# Altium schematic sheet HBridge_Design_1.SchDoc
size B; SheetNumber: 7; SheetTotal: 8
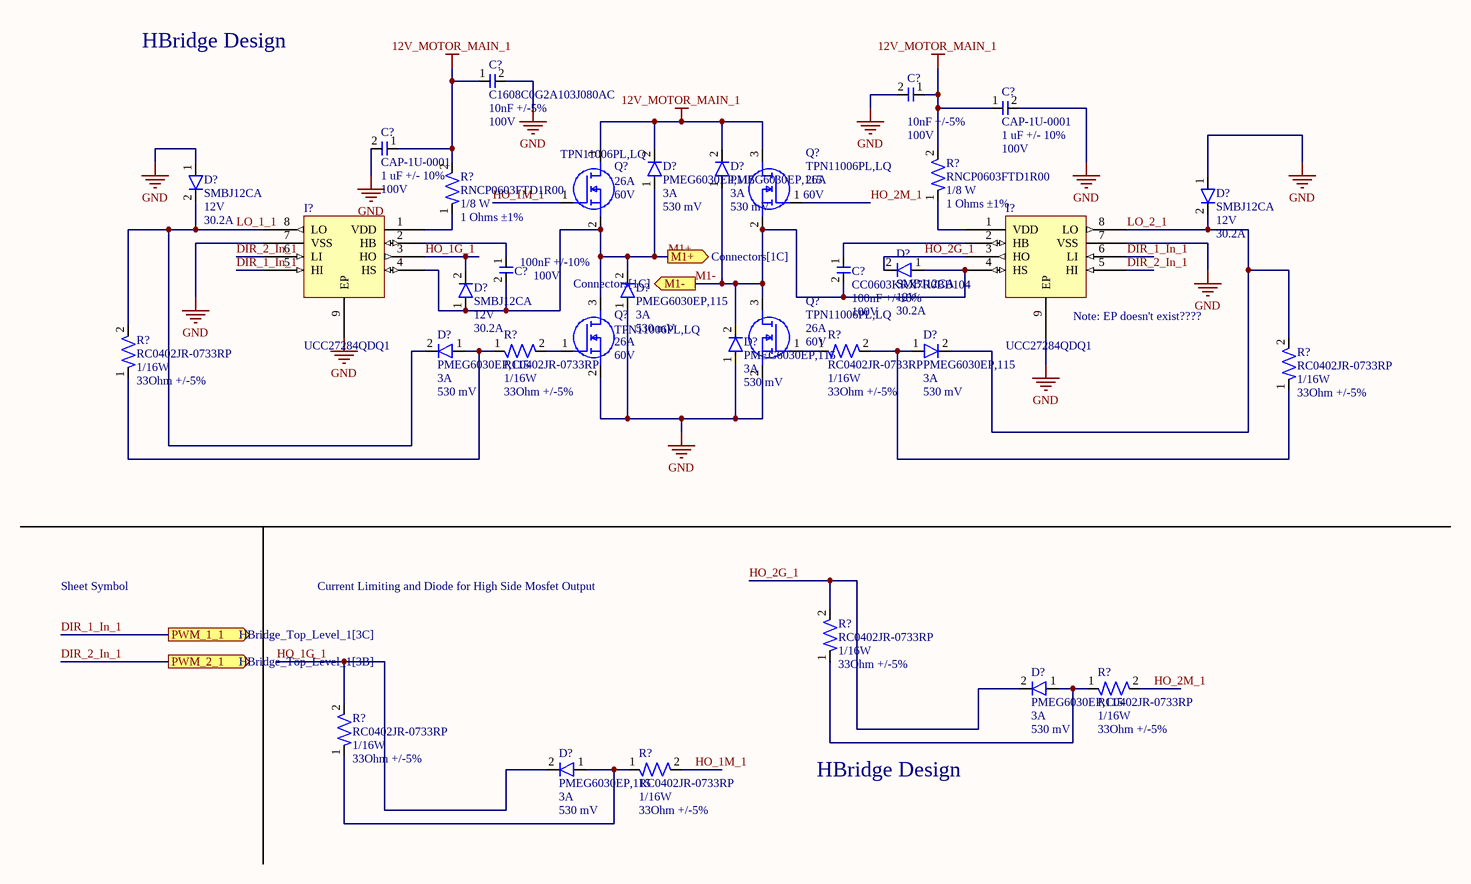
[diagram p0: HBridge_Design_1.SchDoc]

## Parts
(Parts that share a designator on the sheet are numbered #1, #2 ... from top to bottom, then left to right.)
C?#1  C1608C0G2A103J080AC  Capacitance: 10nF +/-5%  Voltage Rating: 100V  [CAP-0603]
C?#2  Capacitance: 10nF +/-5%  Voltage Rating: 100V  [CAP-0603]  (hidden comment: C1608C0G2A103J080AC)
C?#3  CAP-1U-0001  Capacitance: 1 uF +/- 10%  Voltage: 100V  [CAP-1206 - duplicate]
C?#4  CAP-1U-0001  Capacitance: 1 uF +/- 10%  Voltage: 100V  [CAP-1206 - duplicate]
C?#5  Capacitance: 100nF +/-10%  Voltage Rating: 100V  [CAP-0603]  (hidden comment: CC0603KRX7R0BB104)
C?#6  CC0603KRX7R0BB104  Capacitance: 100nF +/-10%  Voltage Rating: 100V  [CAP-0603]
D?#1  PMEG6030EP,115  Current Rating: 3A  Vf (Voltage Forward): 530 mV  [DIO-SOD128]
D?#2  PMEG6030EP,115  Current Rating: 3A  Vf (Voltage Forward): 530 mV  [DIO-SOD128]
D?#3  SMBJ12CA  Standoff Voltage: 12V  Current Rating: 30.2A  [DO-214AA (SMBJ)]
D?#4  SMBJ12CA  Standoff Voltage: 12V  Current Rating: 30.2A  [DO-214AA (SMBJ)]
D?#5  SMBJ12CA  Standoff Voltage: 12V  Current Rating: 30.2A  [DO-214AA (SMBJ)]
D?#6  PMEG6030EP,115  Current Rating: 3A  Vf (Voltage Forward): 530 mV  [DIO-SOD128]
D?#7  SMBJ12CA  Standoff Voltage: 12V  Current Rating: 30.2A  [DO-214AA (SMBJ)]
D?#8  PMEG6030EP,115  Current Rating: 3A  Vf (Voltage Forward): 530 mV  [DIO-SOD128]
D?#9  PMEG6030EP,115  Current Rating: 3A  Vf (Voltage Forward): 530 mV  [DIO-SOD128]
D?#10  PMEG6030EP,115  Current Rating: 3A  Vf (Voltage Forward): 530 mV  [DIO-SOD128]
D?#11  PMEG6030EP,115  Current Rating: 3A  Vf (Voltage Forward): 530 mV  [DIO-SOD128]
D?#12  PMEG6030EP,115  Current Rating: 3A  Vf (Voltage Forward): 530 mV  [DIO-SOD128]
I?#1  UCC27284QDQ1  [IC-BUCK-8SOIC]
I?#2  UCC27284QDQ1  [IC-BUCK-8SOIC]
Q?#1  TPN11006PL,LQ  Id-Continuous: 26A  VDS-Max: 60V  [NMOS-8TSON]
Q?#2  TPN11006PL,LQ  Id-Continuous: 26A  VDS-Max: 60V  [NMOS-8TSON]
Q?#3  TPN11006PL,LQ  Id-Continuous: 26A  VDS-Max: 60V  [NMOS-8TSON]
Q?#4  TPN11006PL,LQ  Id-Continuous: 26A  VDS-Max: 60V  [NMOS-8TSON]
R?#1  RNCP0603FTD1R00  Power: 1/8 W  Resistance: 1 Ohms ±1%  [RES-0603]
R?#2  RNCP0603FTD1R00  Power: 1/8 W  Resistance: 1 Ohms ±1%  [RES-0603]
R?#3  RC0402JR-0733RP  Power Rating: 1/16W  Resistance: 33Ohm +/-5%  [RES-0402]
R?#4  RC0402JR-0733RP  Power Rating: 1/16W  Resistance: 33Ohm +/-5%  [RES-0402]
R?#5  RC0402JR-0733RP  Power Rating: 1/16W  Resistance: 33Ohm +/-5%  [RES-0402]
R?#6  RC0402JR-0733RP  Power Rating: 1/16W  Resistance: 33Ohm +/-5%  [RES-0402]
R?#7  RC0402JR-0733RP  Power Rating: 1/16W  Resistance: 33Ohm +/-5%  [RES-0402]
R?#8  RC0402JR-0733RP  Power Rating: 1/16W  Resistance: 33Ohm +/-5%  [RES-0402]
R?#9  RC0402JR-0733RP  Power Rating: 1/16W  Resistance: 33Ohm +/-5%  [RES-0402]
R?#10  RC0402JR-0733RP  Power Rating: 1/16W  Resistance: 33Ohm +/-5%  [RES-0402]

## Ports
M1+ (out, see Connectors[1C]), M1- (out, see Connectors[1C]), PWM_1_1 (out, see HBridge_Top_Level_1[3C]), PWM_2_1 (out, see HBridge_Top_Level_1[3B])

## Nets
12V_MOTOR_MAIN_1: C?#1.1 C?#2.1 C?#3.1 C?#4.1 D?#1.2 D?#2.2 Q?#1.3(D) Q?#2.3(D) R?#1.2 R?#2.2
GND: C?#1.2 C?#2.2 C?#3.2 C?#4.2 D?#3.1 D?#4.1 D?#6.1 D?#8.1 I?#1.7(VSS) I?#1.9(EP) I?#2.7(VSS) I?#2.9(EP) Q?#3.2(S) Q?#4.2(S)
DIR_1_In_1: I?#1.5(HI) I?#2.6(LI) ; port PWM_1_1
DIR_2_In_1: I?#1.6(LI) I?#2.5(HI) ; port PWM_2_1
HO_1G_1: D?#7.2 D?#12.2 I?#1.3(HO) R?#9.2
HO_1M_1: Q?#1.1(G) R?#10.2
HO_2G_1: D?#5.2 D?#11.2 I?#2.3(HO) R?#7.2
HO_2M_1: Q?#2.1(G) R?#8.2
LO_1_1: D?#3.2 D?#9.2 I?#1.8(LO) R?#3.2
LO_2_1: D?#4.2 D?#10.2 I?#2.8(LO) R?#6.2
M1+: C?#5.2 D?#1.1 D?#6.2 D?#7.1 I?#1.4(HS) Q?#1.2(S) Q?#3.3(D) ; port M1+
M1-: C?#6.2 D?#2.1 D?#5.1 D?#8.2 I?#2.4(HS) Q?#2.2(S) Q?#4.3(D) ; port M1-
NetC?#5_1: C?#5.1 I?#1.2(HB)
NetC?#6_1: C?#6.1 I?#2.2(HB)
NetD?#9_1: D?#9.1 R?#3.1 R?#4.1
NetD?#10_1: D?#10.1 R?#5.2 R?#6.1
NetD?#11_1: D?#11.1 R?#7.1 R?#8.1
NetD?#12_1: D?#12.1 R?#9.1 R?#10.1
NetI?#1_1: I?#1.1(VDD) R?#2.1
NetI?#2_1: I?#2.1(VDD) R?#1.1
NetQ?#3_1: Q?#3.1(G) R?#4.2
NetQ?#4_1: Q?#4.1(G) R?#5.1

## Notes on the sheet
- HBridge Design
- (near I?#2) Note: EP doesn't exist????
- Sheet Symbol
- Current Limiting and Diode for High Side Mosfet Output

## Library data of the parts
C?#1 C?#2 = CAP-10N-0002: CAP CER 10000PF 100V C0G 0603; Manufacturer: TDK Corporation; Temperature Coefficient: C0G/NP0; Assembled?: no; Manufacturer Part Number: C1608C0G2A103J080AC; Package Size: 0603
C?#3 C?#4 = CAP-1U-0001: 1 µF ±10% 100V Ceramic Capacitor X7R 1206 (3216 Metric)
C?#5 C?#6 = CAP-100N-0001: CAP CER 0.1UF 100V X7R 0603; Manufacturer: YAGEO; Assembled?: no; Manufacturer Part Number: CC0603KRX7R0BB104; Temperature Coefficient: X7R; Package Size: 0603
D?#1 D?#2 D?#6 D?#8-D?#12 = DIO-0.53V-0001: Diode Schottky 60 V 3A Surface Mount SOD-128/CFP5; Manufacturer: Nexperia USA Inc.; Assembled: no; Manufacturer Part Number: PMEG6030EP,115; Package: SOD-128/CFP5
D?#3-D?#5 D?#7 = DIO-19.9V-0001: 19.9V Clamp 30.2A Ipp Tvs Diode Surface Mount DO-214AA (SMBJ); Manufacturer: Littlefuse Inc.; Assembled: No; Breakdown Voltage: 13.3; Manufacturer Part Number: SMBJ12CA; Package: DO-214AA (SMBJ)
I?#1 I?#2 = IC-GDRV-0001: Gate Drivers Automotive 3-A, 120-V half bridge gate driver with 5-V UVLO and enable 8-SOIC -40 to 125; Manufacturer: Texas Instruments; Assembled?: no; VCC-Max: 16V; VCC-Min: 5.5V; Load Voltage-Max: 120V; Supply Current: 3A; Manufacturer Part Number: UCC27284QDQ1; Package: SOIC-8
Q?#1-Q?#4 = NMOS-26A-0001: MOSFET N-CH 60V 200MA SOT23; Manufacturer: Toshiba; FET type: N-Channel; Rds On-Max: 18.1mOhm; Vgs-Max: 20V; Assembled?: no; Manufacturer Part Number: TPN11006PL,LQ; Package: 8-TSON Advance
R?#1 R?#2 = RES-1-0001: 1 Ohms ±1% 0.125W, 1/8W Chip Resistor 0603 (1608 Metric) Anti-Sulfur Thin Film
R?#3-R?#10 = RES-33-0001: RES SMD 33 OHM 5% 1/16W 0402; Manufacturer: YAGEO; Assembled?: no; Manufacturer Part Number: RC0402JR-0733RP; Package Size: 0402